# Altium project SunflowerPCB.PrjPcb (part 2 of 2)

## Sheet PowerSystem.SchDoc: SunflowerPowerSystem
size A4; Date: 9/26/2026; Author: Ben Robbins; DocumentNumber: 3; Revision: 1; SheetNumber: 3; SheetTotal: 3
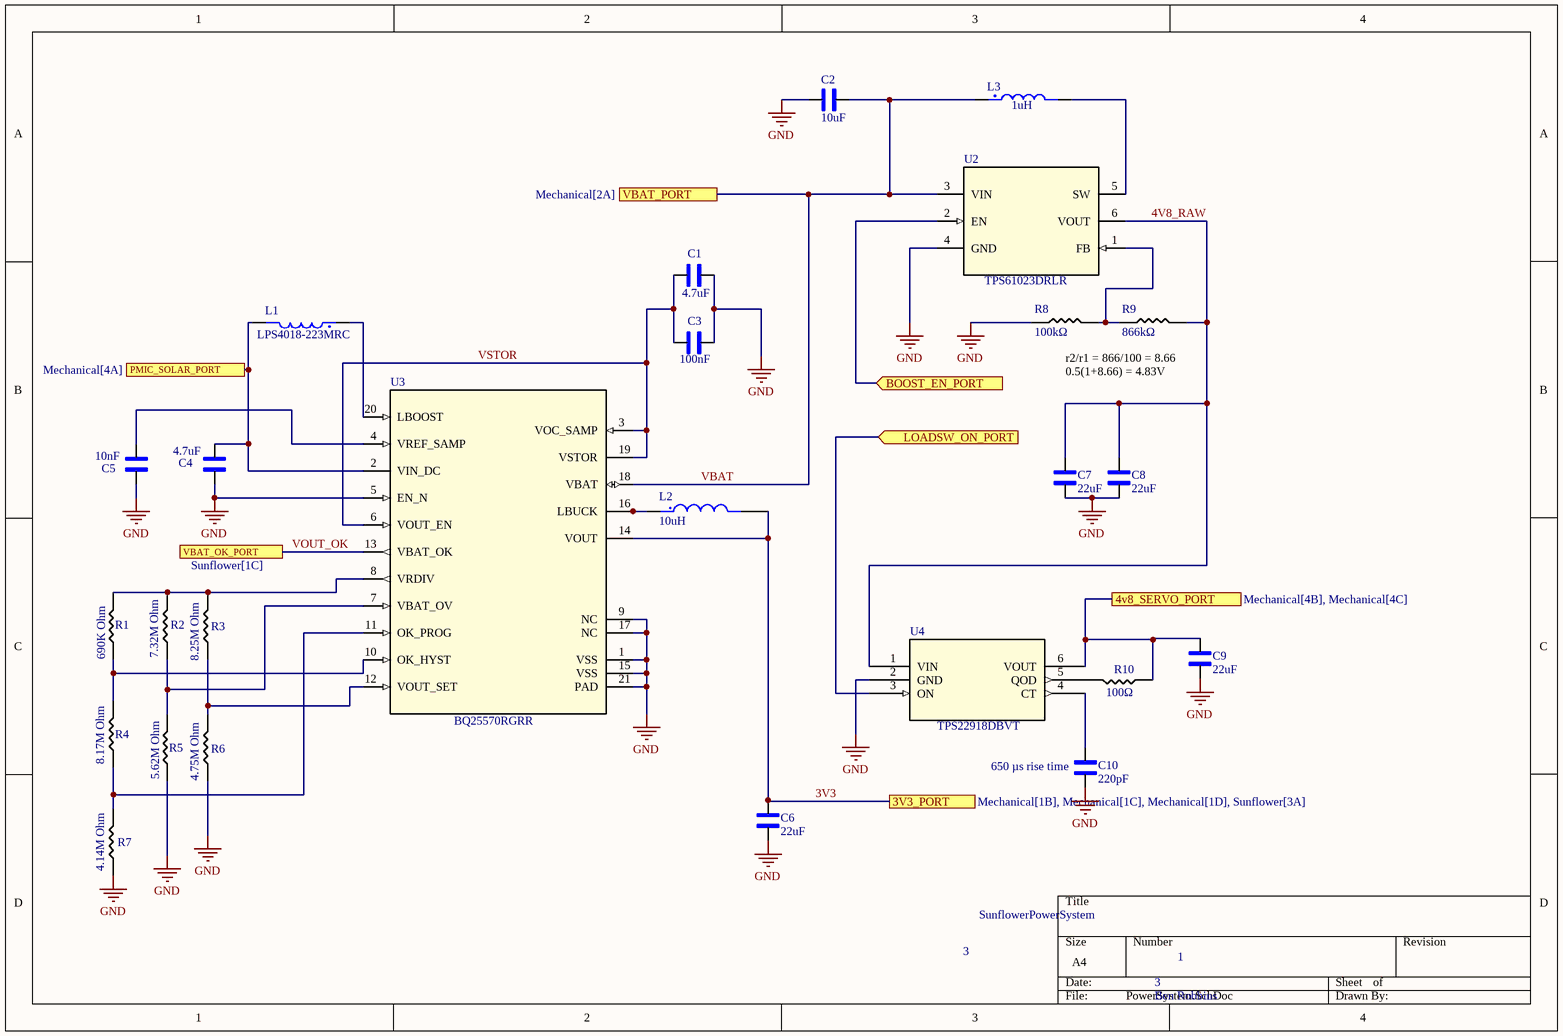
[diagram p2: PowerSystem.SchDoc]

### Parts
C1  4.7uF  [0805_Capacitor]
C2  10uF  [0805_Capacitor]
C3  100nF  [0402_Capacitor]
C4  4.7uF  [0805_Capacitor]
C5  10nF  [0402_Capacitor]
C6  22uF  [0805_Capacitor]
C7  22uF  [0805_Capacitor]
C8  22uF  [0805_Capacitor]
C9  22uF  [0805_Capacitor]
C10  220pF  [0603_Capacitor]
L1  LPS4018-223MRC  [IND_LPS4018-223MRC]
L2  10uH  [IND_LPS4018-223MRC]
L3  1uH  [WE-MAPI_4030]
R1  value 690K Ohm  [0603_Resistor]  (hidden comment: 690K)
R2  value 7.32M Ohm  [0603_Resistor]  (hidden comment: 7.32)
R3  value 8.25M Ohm  [0603_Resistor]  (hidden comment: 8.25M)
R4  value 8.17M Ohm  [0603_Resistor]  (hidden comment: 8.17M)
R5  value 5.62M Ohm  [0603_Resistor]  (hidden comment: 5.62)
R6  value 4.75M Ohm  [0603_Resistor]  (hidden comment: 4.75M)
R7  value 4.14M Ohm  [0603_Resistor]  (hidden comment: 4.14M)
R8  value 100kΩ  [0603_Resistor]  (hidden comment: 100kOhm)
R9  value 866kΩ  [0603_Resistor]  (hidden comment: 866kOhm)
R10  value 100Ω  [0603_Resistor]  (hidden comment: 100Ohm)
U2  TPS61023DRLR  [DRL0006A]
U3  BQ25570RGRR  [RGR0020A]
U4  TPS22918DBVT  [TPS22918DBVT]

### Ports
3V3_PORT (see Mechanical[1B], Mechanical[1C], Mechanical[1D], Sunflower[3A]), 4v8_SERVO_PORT (see Mechanical[4B], Mechanical[4C]), BOOST_EN_PORT (in), LOADSW_ON_PORT (in), PMIC_SOLAR_PORT (see Mechanical[4A]), VBAT_OK_PORT (see Sunflower[1C]), VBAT_PORT (see Mechanical[2A])

### Nets
GND: C1.2 C2.1 C3.2 C4.1 C5.1 C6.1 C7.1 C8.1 C9.1 C10.1 R5.1 R6.1 R7.1 R8.1 U2.4(GND) U3.1(VSS) U3.5(EN_N) U3.9(NC) U3.15(VSS) U3.17(NC) U3.21(PAD) U4.2(GND)
3V3: C6.2 L2.2 U3.14(VOUT) ; port 3V3_PORT
4V8_RAW: C7.2 C8.2 R9.2 U2.6(VOUT) U4.1(VIN)
VBAT: C2.2 L3.1 U2.3(VIN) U3.18(VBAT) ; port VBAT_PORT
VOUT_OK: U3.13(VBAT_OK) ; port VBAT_OK_PORT
VSTOR: C1.1 C3.1 U3.3(VOC_SAMP) U3.6(VOUT_EN) U3.19(VSTOR)
NetC4_2: C4.2 L1.2 U3.2(VIN_DC) ; port PMIC_SOLAR_PORT
NetC5_2: C5.2 U3.4(VREF_SAMP)
NetC9_2: C9.2 R10.1 U4.6(VOUT) ; port 4v8_SERVO_PORT
NetC10_2: C10.2 U4.4(CT)
NetL1_1: L1.1 U3.20(LBOOST)
NetL2_1: L2.1 U3.16(LBUCK)
NetL3_2: L3.2 U2.5(SW)
NetR1_1: R1.1 R4.2 U3.10(OK_HYST)
NetR1_2: R1.2 R2.2 R3.2 U3.8(VRDIV)
NetR2_1: R2.1 R5.2 U3.7(VBAT_OV)
NetR3_1: R3.1 R6.2 U3.12(VOUT_SET)
NetR4_1: R4.1 R7.2 U3.11(OK_PROG)
NetR8_2: R8.2 R9.1 U2.1(FB)
NetR10_2: R10.2 U4.5(QOD)
NetU2_2: U2.2(EN) ; port BOOST_EN_PORT
NetU4_3: U4.3(ON) ; port LOADSW_ON_PORT

### Notes on the sheet
- r2/r1 = 866/100 = 8.66
  0.5(1+8.66) = 4.83V
- (near C10) 650 µs rise time

### Library data of the parts
C1 C4 = C_0805_4u7: 4.7 µF ceramic input capacitor; Type: Basic; Value: 4.7uF
C2 = C_0805_10uF: 10 µF ceramic input capacitor; Type: Basic; Value: 10uF
C3 = C_0402_100nF: 0402 ceramic decoupling capacitor, 0.1 µF; MFR Part #: CL05A105KA5NQNC; Type: Basic; Datasheet: https://datasheet.lcsc.com/szlcsc/Samsung-Electro-Mechanics-CL05A105KA5NQNC_C52923.pdf; LCSC Part#: C52923; Value: 100nF
C5 = C_0402_10nF: 10 nF low-leakage MPPT reference capacitor; MFR Part #: CL05A105KA5NQNC; Type: Basic; Datasheet: https://datasheet.lcsc.com/szlcsc/Samsung-Electro-Mechanics-CL05A105KA5NQNC_C52923.pdf; LCSC Part#: C52923; Value: 10nF
C6-C9 = C_0805_22uF: 22 µF ceramic buck converter output capacitor; Type: Basic; Value: 22uF
  C7-C9: Digikey Part Number: 1276-7092-1-ND
C10 = C_0603_220pF: Ceramic Capacitor, Multilayer, Ceramic, 25V, 5% +Tol, 5% -Tol, C0G, 30ppm/Cel TC, 0.00022uF, Surface Mount, 0603; Manufacturer: KYOCERA AVX; Manufacturer Part Number: KGM15ACG1E221JT; Supplier: DigiKey; Supplier Part Number: 478-KGM15ACG1E221JTCT-ND; RoHS: Compliant; Category: Ceramic Capacitors; Stock: 79617; Pricing: 1=0.1, 10=0.043, 50=0.029, 100=0.0248, 500=0.01772 (USD); Case/Package: 0603; China RoHS: Compliant; Dielectric Material: Ceramic; Height: 900µm; Length: 1.6mm; Lifecycle Status: Production; Max Operating Temperature: 125°C; Min Operating Temperature: -55°C; Mounting Technology: Surface Mount; Number of Terminals: 2; REACH SVHC: Unaffected; Tolerance: 5%; Voltage Rating (DC): 25V; Width: 810µm; ComponentLink1URL: https://datasheet.octopart.com:443/KGM15ACG1E221JT-KYOCERA-AVX-datasheet-182064292.pdf?src-supplier=IHS; ComponentLink1Description: https://datasheet.octopart.com:443/KGM15ACG1E221JT-KYOCERA-AVX-datasheet-182064292.pdf?src-supplier=IHS; ComponentLink2URL: https://datasheet.octopart.com:443/KGM15ACG1E221JT-KYOCERA-AVX-datasheet-178027269.pdf?src-supplier=TME; ComponentLink2Description: https://datasheet.octopart.com:443/KGM15ACG1E221JT-KYOCERA-AVX-datasheet-178027269.pdf?src-supplier=TME; ComponentLink3URL: http://sigma.octopart.com:80/conflict_mineral_statement/AVX-company-34.pdf?src-supplier=Compliance+Statements; ComponentLink3Description: http://sigma.octopart.com:80/conflict_mineral_statement/AVX-company-34.pdf?src-supplier=Compliance+Statements; ComponentLink4URL: http://sigma.octopart.com:80/reach_statement/AVX-company-19.pdf?src-supplier=Compliance+Statements; ComponentLink4Description: http://sigma.octopart.com:80/reach_statement/AVX-company-19.pdf?src-supplier=Compliance+Statements; Digikey Part Number: 478-KGM15ACG1E221JTCT-ND; Value: 220pF
L1 = LPS4018-223MRC: 22 ÂµH Shielded Drum Core Inductor 650 mA 360mOhm Max Nonstandard; MF: Coilcraft; SnapEDA_Link: https://www.snapeda.com/parts/LPS4018-223MRC/Coilcraft/view-part/?ref=snap; Package: None; Value: *; MP: LPS4018-223MRC; Check_prices: https://www.snapeda.com/parts/LPS4018-223MRC/Coilcraft/view-part/?ref=eda
L2 = L_10uH_Buck: 10 µH buck converter inductor; MF: Coilcraft; MP: LPS4018-223MRC; SnapEDA_Link: https://www.snapeda.com/parts/LPS4018-223MRC/Coilcraft/view-part/?ref=snap; Package: None; Value: *; Check_prices: https://www.snapeda.com/parts/LPS4018-223MRC/Coilcraft/view-part/?ref=eda
L3 = L_1uH_Boost: Inductor Power Shielded Wirewound 1uH 20% 100KHz Metal 10.25A 0.0135Ohm DCR T/R Automotive AEC-Q200; Manufacturer: Wurth Elektronik; Manufacturer Part Number: 74438357010; Manufacturer Lifecycle Status: ACTIVE; Current Rating: 7.4A; DC Resistance (DCR): 11.6mΩ; Saturation Current: 6.2A; Self Resonant Frequency: 59MHz; ESR: 13.5mΩ; YEOL: 1 = Estimated lifetime > 10 years; Value: 1µH; Supplier: DigiKey; Supplier Part Number: 732-11197-6-ND; RoHS: Compliant; Category: Fixed Inductors; Stock: 2457; Pricing: 1=1.69, 10=1.607, 50=1.548, 100=1.407 (USD); Ambient Temperature Range High: 85°C; Ambient Temperature Range Low: -40°C; Height: 3.1mm; Inductance Tolerance: 20%; Length: 4mm; Lifecycle Status: Production; Max Operating Temperature: 125°C; Min Operating Temperature: -40°C; Pins: 2; RMS Current (Irms): 7.4A; Test Frequency: 100kHz; Tolerance: 20%; Width: 4mm; ComponentLink1URL: https://datasheet.octopart.com:443/74438357010-Wurth-Elektronik-datasheet-168490242.pdf?src-supplier=Wurth+Elektronik; ComponentLink1Description: https://datasheet.octopart.com:443/74438357010-Wurth-Elektronik-datasheet-168490242.pdf?src-supplier=Wurth+Elektronik; ComponentLink2URL: https://datasheet.octopart.com:443/74438357010-W%C3%BCrth-Elektronik-datasheet-154577405.pdf?src-supplier=Upverter; ComponentLink2Description: https://datasheet.octopart.com:443/74438357010-W%C3%BCrth-Elektronik-datasheet-154577405.pdf?src-supplier=Upverter; ComponentLink3URL: https://datasheet.octopart.com:443/74438357010-Wurth-Elektronik-datasheet-181967671.pdf?src-supplier=Newark; ComponentLink3Description: https://datasheet.octopart.com:443/74438357010-Wurth-Elektronik-datasheet-181967671.pdf?src-supplier=Newark; ComponentLink4URL: https://datasheet.octopart.com:443/74438357010-W%C3%BCrth-Elektronik-datasheet-104453236.pdf?src-supplier=element14+APAC; ComponentLink4Description: https://datasheet.octopart.com:443/74438357010-W%C3%BCrth-Elektronik-datasheet-104453236.pdf?src-supplier=element14+APAC; Digikey Part Number: 732-11197-1-ND
R1 = R_0603_690Kohm: 690 kΩ, 1% tolerance, 0603 SMD battery-good hysteresis-setting resistor; Type: Basic
R2 = R_0603_7.32MOhm: 7.32 MΩ: 4.75 MΩ, 1% tolerance, 0603 SMD buck converter output voltage-setting resistor; Type: Basic
R3 = R_0603_8.25MOhm: 8.25 MΩ, 1% tolerance, 0603 SMD buck converter output voltage-setting resistor; Type: Basic
R4 = R_0603_8.17Mohm: 8.17 MΩ, 1% tolerance, 0603 SMD battery-good hysteresis-setting resistor; Type: Basic
R5 = R_0603_5.62MOhm: 5.62 MΩ: 4.75 MΩ, 1% tolerance, 0603 SMD buck converter output voltage-setting resistor; Type: Basic
R6 = R_0603_4.75MOhm_1: 4.75 MΩ, 1% tolerance, 0603 SMD buck converter output voltage-setting resistor; Type: Basic
R7 = R_0603_4.14Mohm: 4.14 MΩ, 1% tolerance, 0603 SMD battery-good hysteresis-setting resistor; Type: Basic
R8 = R_0603_100kOhm: Res Thick Film 0603 100K Ohm 1% 0.1W(1/10W) ±100ppm/C Pad SMD Automotive T/R; Manufacturer: Stackpole Electronics; Manufacturer Part Number: RMCF0603FT100K; Max Power Dissipation: 100mW; Temperature Coefficient: 100ppm/°C; Voltage Rating: 75V; Supplier: DigiKey; Supplier Part Number: RMCF0603FT100KDKR-ND; RoHS: Compliant; Category: Chip SMD Resistors; Stock: 1796629; Pricing: 1=0.1, 10=0.021, 25=0.0152, 50=0.012, 100=0.0096, 250=0.00736, 500=0.00608, 1000=0.00509 (USD); Case/Package: 0603; Case Code (Imperial): 0603; Case Code (Metric): 1608; China RoHS: Non-Compliant; Composition: Thick Film; Contact Plating: Tin; Depth: 800µm; Features: Automotive AEC-Q200; Height: 450µm; Lead Free: Lead Free; Length: 1.55mm; Lifecycle Status: Production; Max Operating Temperature: 155°C; Military Standard: Not; Min Operating Temperature: -55°C; Mounting Technology: Surface Mount; Number of Terminals: 2; Number of Terminations: 2; Packaging: Cut Tape (CT); Power Rating: 100mW; Radiation Hardening: No; Ratings: AEC-Q200; REACH SVHC: Unaffected; Schedule B: 8533210045, 8533210045|8533210045, 8533210045|8533210045|8533210045, 8533210045|8533210045|8533210045|8533210045; Tolerance: 1%; Width: 800µm; Working Voltage: 75V; ComponentLink1URL: https://datasheet.octopart.com:443/RMCF0603FT100K-Stackpole-Electronics-datasheet-182148065.pdf?src-supplier=IHS; ComponentLink1Description: https://datasheet.octopart.com:443/RMCF0603FT100K-Stackpole-Electronics-datasheet-182148065.pdf?src-supplier=IHS; ComponentLink2URL: https://datasheet.octopart.com:443/RMCF0603FT100K-Stackpole-Electronics-datasheet-12534581.pdf?src-supplier=Upverter; ComponentLink2Description: https://datasheet.octopart.com:443/RMCF0603FT100K-Stackpole-Electronics-datasheet-12534581.pdf?src-supplier=Upverter; ComponentLink3URL: https://datasheet.octopart.com:443/RMCF0603FT100K-Stackpole-Electronics-datasheet-28504820.pdf?src-supplier=Upverter; ComponentLink3Description: https://datasheet.octopart.com:443/RMCF0603FT100K-Stackpole-Electronics-datasheet-28504820.pdf?src-supplier=Upverter; ComponentLink4URL: https://datasheet.octopart.com:443/RMCF0603FT100K-Stackpole-Electronics-datasheet-12510902.pdf?src-supplier=Upverter; ComponentLink4Description: https://datasheet.octopart.com:443/RMCF0603FT100K-Stackpole-Electronics-datasheet-12510902.pdf?src-supplier=Upverter; ComponentLink5URL: https://datasheet.octopart.com:443/RMCF0603FT100K-Stackpole-Electronics-datasheet-141193804.pdf?src-supplier=Stackpole+Electronics; ComponentLink5Description: https://datasheet.octopart.com:443/RMCF0603FT100K-Stackpole-Electronics-datasheet-141193804.pdf?src-supplier=Stackpole+Electronics; ComponentLink6URL: https://datasheet.octopart.com:443/RMCF0603FT100K-Stackpole-Electronics-datasheet-62091608.pdf?src-supplier=Stackpole+Electronics; ComponentLink6Description: https://datasheet.octopart.com:443/RMCF0603FT100K-Stackpole-Electronics-datasheet-62091608.pdf?src-supplier=Stackpole+Electronics; ComponentLink7URL: https://datasheet.octopart.com:443/RMCF0603FT100K-Stackpole-Electronics-datasheet-10788263.pdf?src-supplier=Stackpole+Electronics; ComponentLink7Description: https://datasheet.octopart.com:443/RMCF0603FT100K-Stackpole-Electronics-datasheet-10788263.pdf?src-supplier=Stackpole+Electronics; ComponentLink8URL: https://datasheet.octopart.com:443/RMCF0603FT100K-Stackpole-Electronics-datasheet-155966809.pdf?src-supplier=Electro+Sonic; ComponentLink8Description: https://datasheet.octopart.com:443/RMCF0603FT100K-Stackpole-Electronics-datasheet-155966809.pdf?src-supplier=Electro+Sonic; ComponentLink9URL: https://datasheet.octopart.com:443/RMCF0603FT100K-Stackpole-Electronics-datasheet-189104164.pdf?src-supplier=Master+Electronics; ComponentLink9Description: https://datasheet.octopart.com:443/RMCF0603FT100K-Stackpole-Electronics-datasheet-189104164.pdf?src-supplier=Master+Electronics; ComponentLink10URL: https://datasheet.octopart.com:443/RMCF0603FT100K-Stackpole-Electronics-datasheet-154799224.pdf?src-supplier=Master+Electronics; ComponentLink10Description: https://datasheet.octopart.com:443/RMCF0603FT100K-Stackpole-Electronics-datasheet-154799224.pdf?src-supplier=Master+Electronics; ComponentLink11URL: https://datasheet.octopart.com:443/RMCF0603FT100K-Stackpole-Electronics-datasheet-11546843.pdf?src-supplier=Arrow+Electronics; ComponentLink11Description: https://datasheet.octopart.com:443/RMCF0603FT100K-Stackpole-Electronics-datasheet-11546843.pdf?src-supplier=Arrow+Electronics; ComponentLink12URL: https://datasheet.octopart.com:443/RMCF0603FT100K-Stackpole-Electronics-datasheet-11547379.pdf?src-supplier=Future+Electronics; ComponentLink12Description: https://datasheet.octopart.com:443/RMCF0603FT100K-Stackpole-Electronics-datasheet-11547379.pdf?src-supplier=Future+Electronics; ComponentLink13URL: https://datasheet.octopart.com:443/RMCF0603FT100K-Stackpole-Electronics-datasheet-8359789.pdf?src-supplier=Future+Electronics; ComponentLink13Description: https://datasheet.octopart.com:443/RMCF0603FT100K-Stackpole-Electronics-datasheet-8359789.pdf?src-supplier=Future+Electronics; ComponentLink14URL: https://datasheet.octopart.com:443/RMCF0603FT100K-Stackpole-Electronics-datasheet-8324226.pdf?src-supplier=Future+Electronics; ComponentLink14Description: https://datasheet.octopart.com:443/RMCF0603FT100K-Stackpole-Electronics-datasheet-8324226.pdf?src-supplier=Future+Electronics; ComponentLink15URL: http://sigma.octopart.com:80/15940719/materials_sheet/Stackpole-Electronics-RMCF0603FT100K.pdf?src-supplier=Compliance+Statements; ComponentLink15Description: http://sigma.octopart.com:80/15940719/materials_sheet/Stackpole-Electronics-RMCF0603FT100K.pdf?src-supplier=Compliance+Statements; ComponentLink16URL: http://sigma.octopart.com:80/141158211/reach_statement/Stackpole-Electronics-RMCF0603FT100K.pdf?src-supplier=Compliance+Statements; ComponentLink16Description: http://sigma.octopart.com:80/141158211/reach_statement/Stackpole-Electronics-RMCF0603FT100K.pdf?src-supplier=Compliance+Statements; ComponentLink17URL: http://sigma.octopart.com:80/141158212/rohs_statement/Stackpole-Electronics-RMCF0603FT100K.pdf?src-supplier=Compliance+Statements; ComponentLink17Description: http://sigma.octopart.com:80/141158212/rohs_statement/Stackpole-Electronics-RMCF0603FT100K.pdf?src-supplier=Compliance+Statements; Digikey Part Number: RMCF0603FT100KCT-ND
R9 = R_0603_866kOhm: Res Thick Film 0603 866K Ohm 1% 0.1W(1/10W) ±100ppm/C Pad SMD Automotive T/R; Manufacturer: Panasonic; Manufacturer Part Number: ERJ-3EKF8663V; Manufacturer Lifecycle Status: ACTIVE; Part Series: Precision Thick Film Chip Resistors; Max Power Dissipation: 100mW; Temperature Coefficient: 100ppm/°C; Voltage Rating: 75V; Supplier: DigiKey; Supplier Part Number: P866KHCT-ND; RoHS: Compliant; Category: Chip SMD Resistors; Stock: 58087; Pricing: 1=0.1, 10=0.039, 25=0.0288, 50=0.0236, 100=0.0195, 250=0.01544, 500=0.01314, 1000=0.01131 (USD); Case/Package: 0603; Case Code (Imperial): 0603; China RoHS: Non-Compliant; Composition: Thick Film; Contact Plating: Tin; Country of Origin: Japan, Mainland China; Depth: 800µm; Export Control Classification Number (ECCN) Code: EAR99; Features: Automotive AEC-Q200; Height: 450µm; Harmonized Tariff Schedule (HTS) Code: 8533.21.00.30; Introduction Date: 1998-02-25; Length: 1.6mm; Lifecycle Status: Production; Max Operating Temperature: 155°C; Military Standard: Not; Min Operating Temperature: -55°C; Mounting Technology: Surface Mount; Number of Terminals: 2; Number of Terminations: 2; Packaging: Cut Tape; Power Rating: 100mW; Ratings: AEC-Q200; REACH SVHC: Unaffected; Schedule B: 8533210045, 8533210045|8533210045, 8533210045|8533210045|8533210045, 8533210045|8533210045|8533210045|8533210045; Termination: SMD/SMT; Tolerance: 1%; Weight: 2.012816mg; Width: 800µm; Working Voltage: 75V; ComponentLink1URL: https://datasheet.octopart.com:443/ERJ-3EKF8663V-Panasonic-datasheet-82288794.pdf?src-supplier=Panasonic; ComponentLink1Description: https://datasheet.octopart.com:443/ERJ-3EKF8663V-Panasonic-datasheet-82288794.pdf?src-supplier=Panasonic; ComponentLink2URL: https://datasheet.octopart.com:443/ERJ-3EKF8663V-Panasonic-datasheet-13266541.pdf?src-supplier=RS+(Formerly+Allied+Electronics); ComponentLink2Description: https://datasheet.octopart.com:443/ERJ-3EKF8663V-Panasonic-datasheet-13266541.pdf?src-supplier=RS+(Formerly+Allied+Electronics); ComponentLink3URL: https://datasheet.octopart.com:443/ERJ-3EKF8663V-Panasonic-datasheet-48891056.pdf?src-supplier=Newark; ComponentLink3Description: https://datasheet.octopart.com:443/ERJ-3EKF8663V-Panasonic-datasheet-48891056.pdf?src-supplier=Newark; ComponentLink4URL: https://datasheet.octopart.com:443/ERJ-3EKF8663V-Panasonic-datasheet-33006990.pdf?src-supplier=Newark; ComponentLink4Description: https://datasheet.octopart.com:443/ERJ-3EKF8663V-Panasonic-datasheet-33006990.pdf?src-supplier=Newark; ComponentLink5URL: https://datasheet.octopart.com:443/ERJ-3EKF8663V-Panasonic---ECG-datasheet-21211697.pdf?src-supplier=Newark; ComponentLink5Description: https://datasheet.octopart.com:443/ERJ-3EKF8663V-Panasonic---ECG-datasheet-21211697.pdf?src-supplier=Newark; ComponentLink6URL: https://datasheet.octopart.com:443/ERJ3EKF8663V-Panasonic-datasheet-168681906.pdf?src-supplier=Farnell; ComponentLink6Description: https://datasheet.octopart.com:443/ERJ3EKF8663V-Panasonic-datasheet-168681906.pdf?src-supplier=Farnell; ComponentLink7URL: https://datasheet.octopart.com:443/ERJ3EKF8663V-Panasonic-datasheet-136608610.pdf?src-supplier=Farnell; ComponentLink7Description: https://datasheet.octopart.com:443/ERJ3EKF8663V-Panasonic-datasheet-136608610.pdf?src-supplier=Farnell; ComponentLink8URL: https://datasheet.octopart.com:443/ERJ-3EKF8663V-Panasonic---ECG-datasheet-15994758.pdf?src-supplier=Farnell; ComponentLink8Description: https://datasheet.octopart.com:443/ERJ-3EKF8663V-Panasonic---ECG-datasheet-15994758.pdf?src-supplier=Farnell; ComponentLink9URL: https://datasheet.octopart.com:443/ERJ-3EKF8663V-Panasonic---ECG-datasheet-10025800.pdf?src-supplier=Farnell; ComponentLink9Description: https://datasheet.octopart.com:443/ERJ-3EKF8663V-Panasonic---ECG-datasheet-10025800.pdf?src-supplier=Farnell; ComponentLink10URL: https://datasheet.octopart.com:443/ERJ-3EKF8663V-Panasonic---ECG-datasheet-8853621.pdf?src-supplier=Farnell; ComponentLink10Description: https://datasheet.octopart.com:443/ERJ-3EKF8663V-Panasonic---ECG-datasheet-8853621.pdf?src-supplier=Farnell; ComponentLink11URL: https://datasheet.octopart.com:443/ERJ-3EKF8663V-Panasonic---ECG-datasheet-5313456.pdf?src-supplier=Farnell; ComponentLink11Description: https://datasheet.octopart.com:443/ERJ-3EKF8663V-Panasonic---ECG-datasheet-5313456.pdf?src-supplier=Farnell; ComponentLink12URL: https://datasheet.octopart.com:443/ERJ-3EKF8663V-Panasonic-datasheet-154766169.pdf?src-supplier=JRH+Electronics; ComponentLink12Description: https://datasheet.octopart.com:443/ERJ-3EKF8663V-Panasonic-datasheet-154766169.pdf?src-supplier=JRH+Electronics; ComponentLink13URL: https://datasheet.octopart.com:443/ERJ3EKF8663V-Panasonic-datasheet-138819429.pdf?src-supplier=Burklin+Elektronik; ComponentLink13Description: https://datasheet.octopart.com:443/ERJ3EKF8663V-Panasonic-datasheet-138819429.pdf?src-supplier=Burklin+Elektronik; ComponentLink14URL: https://datasheet.octopart.com/ERJ-3EKF8663V-Panasonic-datasheet-78375410.pdf; ComponentLink14Description: https://datasheet.octopart.com/ERJ-3EKF8663V-Panasonic-datasheet-78375410.pdf; ComponentLink15URL: https://datasheet.octopart.com:443/ERJ-3EKF8663V-Panasonic-datasheet-118621.pdf?src-supplier=DigiKey; ComponentLink15Description: https://datasheet.octopart.com:443/ERJ-3EKF8663V-Panasonic-datasheet-118621.pdf?src-supplier=DigiKey; ComponentLink16URL: https://datasheet.octopart.com:443/ERJ-3EKF8663V-Panasonic-datasheet-41391857.pdf?src-supplier=Electro+Sonic; ComponentLink16Description: https://datasheet.octopart.com:443/ERJ-3EKF8663V-Panasonic-datasheet-41391857.pdf?src-supplier=Electro+Sonic; Digikey Part Number: P866KHCT-ND
R10 = R_0603_100Ohm: Res Thick Film 0603 100 Ohm 1% 0.1W(1/10W) ±100ppm/C Pad SMD Automotive T/R; Manufacturer: Panasonic; Manufacturer Part Number: ERJ3EKF1000V; Manufacturer Lifecycle Status: ACTIVE; Part Series: Precision Thick Film Chip Resistors; Max Power Dissipation: 100mW; Temperature Coefficient: 100ppm/°C; Voltage Rating: 75V; Supplier: DigiKey; Supplier Part Number: P100HDKR-ND; RoHS: Compliant; Category: Chip SMD Resistors; Stock: 2558784; Pricing: 1=0.1, 10=0.039, 25=0.0288, 50=0.0236, 100=0.0195, 250=0.01544, 500=0.01314, 1000=0.01131 (USD); Case/Package: 0603; Case Code (Imperial): 0603; China RoHS: Non-Compliant; Composition: Thick Film; Contact Plating: Tin; Country of Origin: Japan, Mainland China; Depth: 800µm; Export Control Classification Number (ECCN) Code: EAR99; Features: Automotive AEC-Q200; Height: 450µm; Harmonized Tariff Schedule (HTS) Code: 8533.21.00.30; Introduction Date: 1998-02-25; Lead Free: Lead Free; Length: 1.6mm; Lifecycle Status: Production; Max Operating Temperature: 155°C; Military Standard: Not; Min Operating Temperature: -55°C; Mounting Technology: Surface Mount; Pins: 2; Number of Terminals: 2; Number of Terminations: 2; Packaging: Cut Tape; Power Rating: 100mW; Radiation Hardening: No; Ratings: AEC-Q200; REACH SVHC: Unaffected; Schedule B: 8533210045, 8533210045|8533210045|8533210045|8533210045|8533210045|8533210045, 8533210045|8533210045|8533210045|8533210045|8533210045|8533210045|8533210045|8533210045|8533210045|8533210045|8533210045|8533210045|8533210045|8533210045|8533210045|8533210045|8533210045|8533210045|8533210045|8533210045|8533210045|8533210045|8533210045|85; Termination: SMD/SMT; Tolerance: 1%; Voltage Rating (DC): 75V; Weight: 2.012816mg; Width: 800µm; Working Voltage: 75V; ComponentLink1URL: https://datasheet.octopart.com:443/ERJ3EKF1000V-Panasonic-datasheet-82288794.pdf?src-supplier=Upverter; ComponentLink1Description: https://datasheet.octopart.com:443/ERJ3EKF1000V-Panasonic-datasheet-82288794.pdf?src-supplier=Upverter; ComponentLink2URL: https://datasheet.octopart.com:443/ERJ3EKF1000V-Panasonic-datasheet-13266541.pdf?src-supplier=RS+(Formerly+Allied+Electronics); ComponentLink2Description: https://datasheet.octopart.com:443/ERJ3EKF1000V-Panasonic-datasheet-13266541.pdf?src-supplier=RS+(Formerly+Allied+Electronics); ComponentLink3URL: https://datasheet.octopart.com:443/ERJ3EKF1000V-Panasonic-datasheet-10025800.pdf?src-supplier=Future+Electronics; ComponentLink3Description: https://datasheet.octopart.com:443/ERJ3EKF1000V-Panasonic-datasheet-10025800.pdf?src-supplier=Future+Electronics; ComponentLink4URL: https://datasheet.octopart.com:443/ERJ3EKF1000V-Panasonic-datasheet-8853621.pdf?src-supplier=Future+Electronics; ComponentLink4Description: https://datasheet.octopart.com:443/ERJ3EKF1000V-Panasonic-datasheet-8853621.pdf?src-supplier=Future+Electronics; ComponentLink5URL: https://datasheet.octopart.com:443/ERJ3EKF1000V-Panasonic-datasheet-5313456.pdf?src-supplier=element14+APAC; ComponentLink5Description: https://datasheet.octopart.com:443/ERJ3EKF1000V-Panasonic-datasheet-5313456.pdf?src-supplier=element14+APAC; ComponentLink6URL: https://datasheet.octopart.com:443/ERJ3EKF1000V-Panasonic-datasheet-48891056.pdf?src-supplier=Newark; ComponentLink6Description: https://datasheet.octopart.com:443/ERJ3EKF1000V-Panasonic-datasheet-48891056.pdf?src-supplier=Newark; ComponentLink7URL: https://datasheet.octopart.com:443/ERJ3EKF1000V-Panasonic-datasheet-168681906.pdf?src-supplier=Newark; ComponentLink7Description: https://datasheet.octopart.com:443/ERJ3EKF1000V-Panasonic-datasheet-168681906.pdf?src-supplier=Newark; ComponentLink8URL: https://datasheet.octopart.com:443/ERJ3EKF1000V-Panasonic-datasheet-136608610.pdf?src-supplier=Newark; ComponentLink8Description: https://datasheet.octopart.com:443/ERJ3EKF1000V-Panasonic-datasheet-136608610.pdf?src-supplier=Newark; ComponentLink9URL: https://datasheet.octopart.com:443/ERJ-3EKF1000V-Panasonic-datasheet-154766169.pdf?src-supplier=Master+Electronics; ComponentLink9Description: https://datasheet.octopart.com:443/ERJ-3EKF1000V-Panasonic-datasheet-154766169.pdf?src-supplier=Master+Electronics; ComponentLink10URL: https://datasheet.octopart.com:443/ERJ3EKF1000V-Panasonic-datasheet-138819429.pdf?src-supplier=Burklin+Elektronik; ComponentLink10Description: https://datasheet.octopart.com:443/ERJ3EKF1000V-Panasonic-datasheet-138819429.pdf?src-supplier=Burklin+Elektronik; ComponentLink11URL: https://datasheet.octopart.com/ERJ3EKF1000V-Panasonic-datasheet-78375410.pdf; ComponentLink11Description: https://datasheet.octopart.com/ERJ3EKF1000V-Panasonic-datasheet-78375410.pdf; ComponentLink12URL: https://datasheet.octopart.com:443/ERJ3EKF1000V-Panasonic-datasheet-7538305.pdf?src-supplier=Jameco+(USA); ComponentLink12Description: https://datasheet.octopart.com:443/ERJ3EKF1000V-Panasonic-datasheet-7538305.pdf?src-supplier=Jameco+(USA); ComponentLink13URL: https://datasheet.octopart.com:443/ERJ-3EKF1000V-Panasonic-datasheet-118621.pdf?src-supplier=DigiKey; ComponentLink13Description: https://datasheet.octopart.com:443/ERJ-3EKF1000V-Panasonic-datasheet-118621.pdf?src-supplier=DigiKey; ComponentLink14URL: https://datasheet.octopart.com:443/ERJ-3EKF1000V-Panasonic-datasheet-41391857.pdf?src-supplier=Electro+Sonic; ComponentLink14Description: https://datasheet.octopart.com:443/ERJ-3EKF1000V-Panasonic-datasheet-41391857.pdf?src-supplier=Electro+Sonic; Digikey Part Number: P100HCT-ND
U2 = TPS61023DRLR: 3.7-A boost converter with 0.5-V ultra-low input voltage 6-SOT-5X3 -40 to 125; Manufacturer_Name: Texas Instruments; TYPE: TYPE; RefDes: RefDes; Copyright: Copyright (C) 2025 Ultra Librarian. All rights reserved.; Manufacturer_Part_Number: TPS61023DRLR; Digikey Part Number: 296-TPS61023DRLRCT-ND
U3 = BQ25570RGRR: Ultra Low power Harvester power Management IC with boost charger, and Nanopower Buck Converter 20-VQFN -40 to 125; Manufacturer_Name: Texas Instruments; Alternate_PartNumber: BQ25570RGRT; TYPE: TYPE; RefDes: RefDes; Copyright: Copyright (C) 2026 Ultra Librarian. All rights reserved.; Manufacturer_Part_Number: BQ25570RGRR; Application_BuildNumber: *; PartNumber: BQ25570RGRR; PackageReference: RGR0020A; MountType: SMT; CompType: IC; RoHS: Y; Manufacturer: Texas Instruments; Digikey Part Number: 296-39934-1-ND
U4 = TPS22918DBVT: 2A Load Switch

## Nets that join several sheets
GND: Sunflower (C11.2), Mechanical (11 pins), PowerSystem (22 pins)
3V3: Mechanical (H?#2.1 H?#3.1 H?#5.1 H?#6.1), PowerSystem (C6.2 L2.2 U3.14)
NetC4_2: Mechanical (R16.2), PowerSystem (C4.2 L1.2 U3.2)
NetC9_2: Mechanical (H?#1.2 H?#4.2), PowerSystem (C9.2 R10.1 U4.6)
NetH?#2_2: Sunflower (U1.22), Mechanical (H?#2.2)
NetH?#3_2: Sunflower (U1.23), Mechanical (H?#3.2)
NetH?#5_2: Sunflower (U1.24), Mechanical (H?#5.2)
NetH?#6_2: Sunflower (U1.25), Mechanical (H?#6.2)
VBAT: Mechanical (B1.1 H1.1), PowerSystem (C2.2 L3.1 U2.3 U3.18)
VOUT_OK: Sunflower (U1.6), PowerSystem (U3.13)